# Altium schematic sheet dsau-dds-connector.SchDoc: dSAU Motherboard - DDS Connector
size Letter; Engineer: Christopher J. Woodall; Organization: Boston University EDF/ECE; DocumentNumber: 6; Revision: A; SheetNumber: 6; SheetTotal: 10; EMAIL: cwoodall@bu.edu; TeamName: Team 19; ProjectName: dSAU
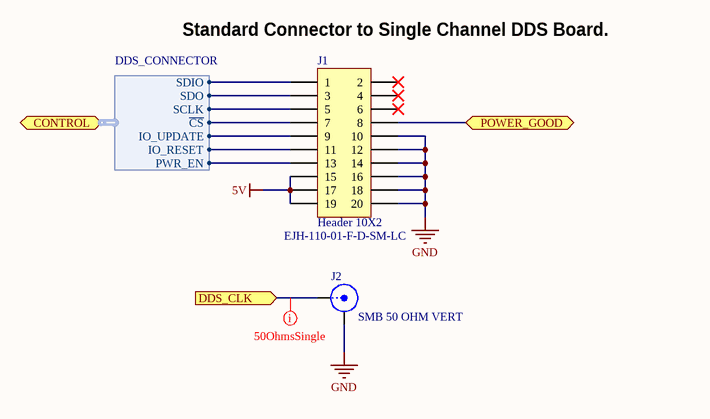
[diagram p0: dsau-dds-connector.SchDoc]

## Parts
J1  Header 10X2  Supplier Part Number 1: EJH-110-01-F-D-SM-LC  [HDR2X10]
J2  SMB 50 OHM VERT  [MOLEX_SMBVERT_731000207]

## Ports
CONTROL (harness DDS_CONNECTOR), DDS_CLK (in), POWER_GOOD

## Harnesses
DDS_CONNECTOR: SDIO, SDO, SCLK, ~{CS}, IO_UPDATE, IO_RESET, PWR_EN

## Nets
5V: J1.15 J1.17 J1.19
GND: J1.10 J1.12 J1.14 J1.16 J1.18 J1.20 J2.2(Y)
DDS_CLK: J2.1(X) ; port DDS_CLK
POWER_GOOD: J1.8 ; port POWER_GOOD
NetJ1_1: J1.1 ; port CONTROL.SDIO
NetJ1_3: J1.3 ; port CONTROL.SDO
NetJ1_5: J1.5 ; port CONTROL.SCLK
NetJ1_7: J1.7 ; port CONTROL.~{CS}
NetJ1_9: J1.9 ; port CONTROL.IO_UPDATE
NetJ1_11: J1.11 ; port CONTROL.IO_RESET
NetJ1_13: J1.13 ; port CONTROL.PWR_EN

Not connected (* = marked no-connect by the designer): J1 2* 4* 6*

## Layout directives
net class 50OhmsSingle: DDS_CLK

## Notes on the sheet
- (near J1) Standard Connector to Single Channel DDS Board.
- Title
- Size:
- Date:
- Letter
- Number:
- Time:
- Revision:
- Sheet
- of
- File:

## Library data of the parts
J1 = Header 10X2: Header, 10-Pin, Dual row; Manufacturer: Samtec; LatestRevisionDate: 17-Jul-2002; LatestRevisionNote: Re-released for DXP Platform.; Publisher: Altium Limited; Manufacturer Part Number: EJH-110-01-F-D-SM-LC; Supplier 1: Samtec; Supplier Additional: Samtec; Supplier Part Number Alternative: HCSD-05-S-02.01-01-N
J2 = SMB: SMB Straight Connector; Manufacturer: Molex Inc; Manufacturer Part Number: 0731000207; LatestRevisionDate: 17-Jul-2002; LatestRevisionNote: Re-released for DXP Platform.; Publisher: Altium Limited; Supplier 1: Digi-Key; Supplier Part Number 1: WM5528-ND